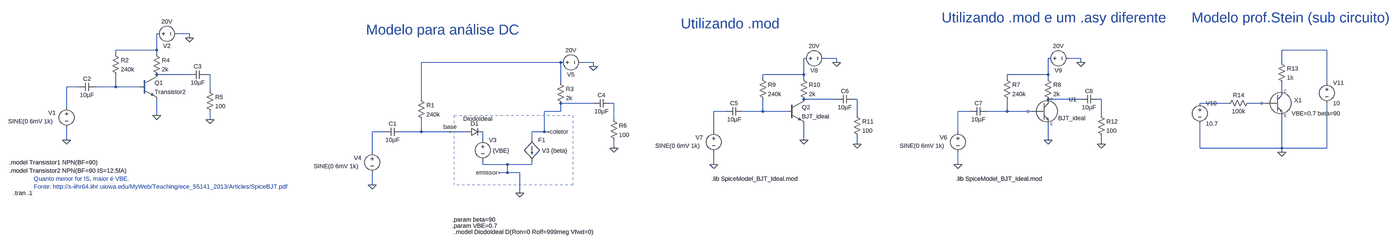
[diagram p0: schematic Tutorial_LTSpice_Ep9-BJT_ideal.asc, whole sheet]
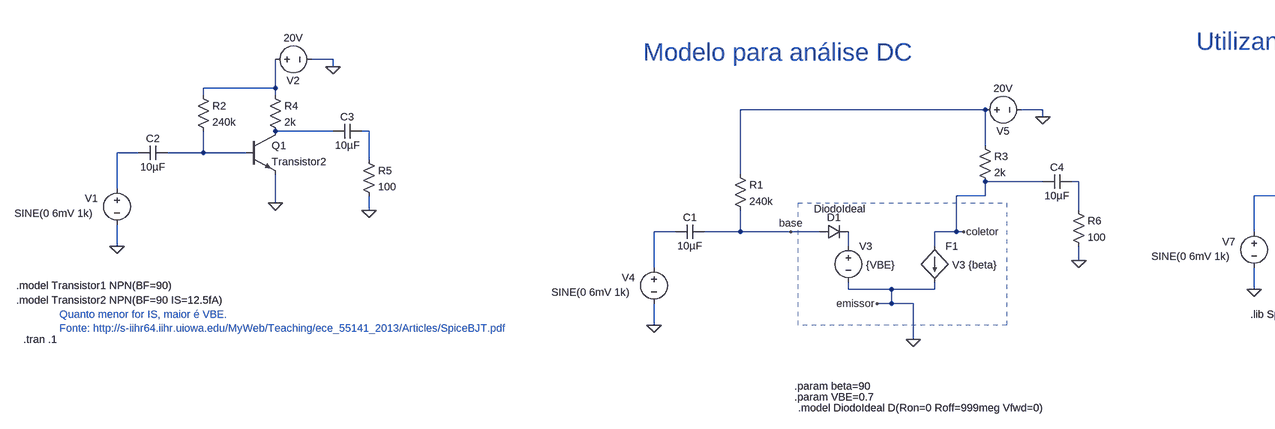
[diagram p1: schematic Tutorial_LTSpice_Ep9-BJT_ideal.asc, part, row 1 of 1, column 1 of 2]
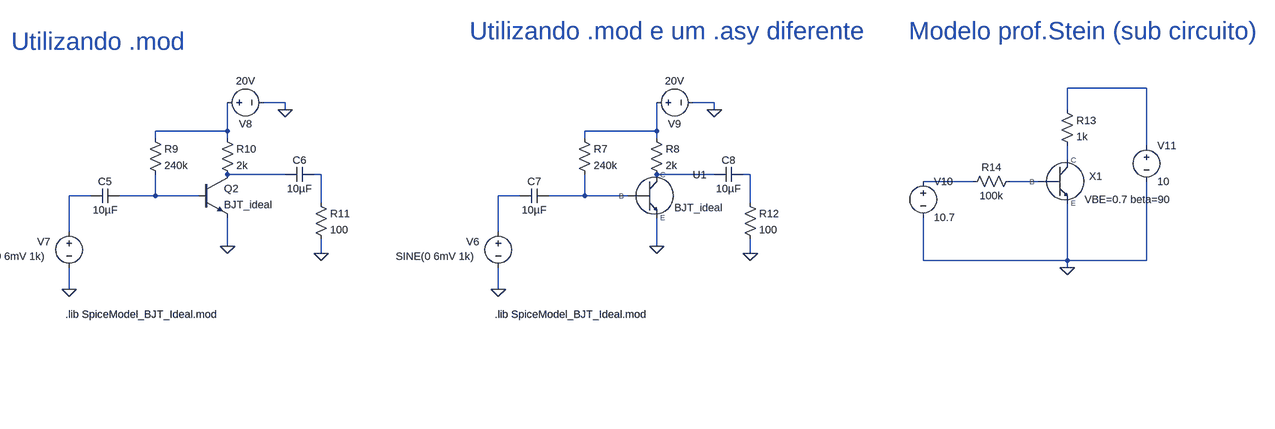
[diagram p2: schematic Tutorial_LTSpice_Ep9-BJT_ideal.asc, part, row 1 of 1, column 2 of 2]
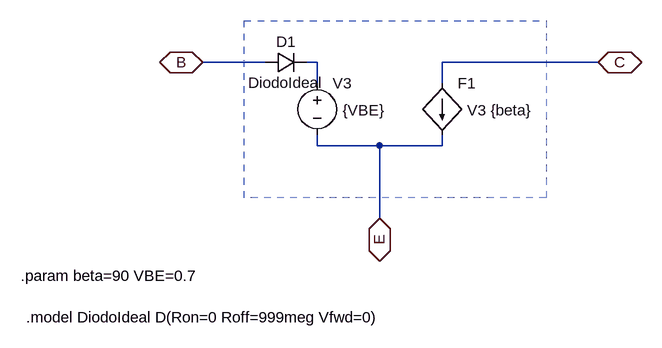
[diagram p3: sub-circuit bjt_ideal.asc]
Tutorial_LTSpice_Ep9-BJT_ideal.asc, the LTspice schematic file:
Version 4
SHEET 1 4108 820
WIRE -880 -608 -928 -608
WIRE -880 -592 -880 -608
WIRE -1008 -544 -1008 -608
WIRE -1008 -544 -1168 -544
WIRE 3776 -544 3600 -544
WIRE -1168 -528 -1168 -544
WIRE -1008 -528 -1008 -544
WIRE 1712 -512 1664 -512
WIRE 2704 -512 2656 -512
WIRE 576 -496 32 -496
WIRE 704 -496 656 -496
WIRE 1712 -496 1712 -512
WIRE 2704 -496 2704 -512
WIRE 3600 -496 3600 -544
WIRE 704 -480 704 -496
WIRE -880 -448 -1008 -448
WIRE -800 -448 -816 -448
WIRE 1584 -448 1584 -512
WIRE 1584 -448 1424 -448
WIRE 2576 -448 2576 -512
WIRE 2576 -448 2416 -448
WIRE 1424 -432 1424 -448
WIRE 1584 -432 1584 -448
WIRE 2416 -432 2416 -448
WIRE 2576 -432 2576 -448
WIRE 576 -416 576 -496
WIRE 3776 -416 3776 -544
WIRE -1312 -400 -1360 -400
WIRE -1168 -400 -1168 -448
WIRE -1168 -400 -1248 -400
WIRE -1072 -400 -1168 -400
WIRE -800 -384 -800 -448
WIRE 3600 -384 3600 -416
WIRE 32 -352 32 -496
WIRE 1712 -352 1584 -352
WIRE 1792 -352 1776 -352
WIRE 2704 -352 2576 -352
WIRE 2784 -352 2768 -352
WIRE 704 -336 576 -336
WIRE 784 -336 768 -336
WIRE 3392 -336 3280 -336
WIRE 3536 -336 3472 -336
WIRE -1360 -320 -1360 -400
WIRE 576 -304 576 -336
WIRE 576 -304 512 -304
WIRE 1280 -304 1232 -304
WIRE 1424 -304 1424 -352
WIRE 1424 -304 1344 -304
WIRE 1520 -304 1424 -304
WIRE 2272 -304 2224 -304
WIRE 2416 -304 2416 -352
WIRE 2416 -304 2336 -304
WIRE 2512 -304 2416 -304
WIRE -1008 -288 -1008 -352
WIRE 1792 -288 1792 -352
WIRE 2784 -288 2784 -352
WIRE -800 -272 -800 -304
WIRE 784 -272 784 -336
WIRE -112 -224 -160 -224
WIRE 32 -224 32 -272
WIRE 32 -224 -48 -224
WIRE 144 -224 32 -224
WIRE 208 -224 144 -224
WIRE 512 -224 512 -304
WIRE 512 -224 464 -224
WIRE 528 -224 512 -224
WIRE 1232 -224 1232 -304
WIRE 2224 -224 2224 -304
WIRE -1360 -192 -1360 -240
WIRE 272 -192 272 -224
WIRE 464 -192 464 -224
WIRE 1584 -192 1584 -256
WIRE 2576 -192 2576 -256
WIRE 1792 -176 1792 -208
WIRE 2784 -176 2784 -208
WIRE 784 -160 784 -192
WIRE 3280 -160 3280 -256
WIRE 3600 -160 3600 -288
WIRE 3600 -160 3280 -160
WIRE 3776 -160 3776 -336
WIRE 3776 -160 3600 -160
WIRE -160 -144 -160 -224
WIRE 3600 -144 3600 -160
WIRE 272 -96 272 -112
WIRE 368 -96 272 -96
WIRE 464 -96 464 -112
WIRE 464 -96 368 -96
WIRE 1232 -96 1232 -144
WIRE 2224 -96 2224 -144
WIRE 368 -64 368 -96
WIRE 368 -64 336 -64
WIRE 416 -64 368 -64
WIRE -160 -16 -160 -64
WIRE 416 16 416 -64
FLAG -800 -272 0
FLAG -1360 -192 0
FLAG -1008 -288 0
FLAG 144 -224 base
FLAG 336 -64 emissor
FLAG 528 -224 coletor
FLAG -880 -592 0
FLAG 784 -160 0
FLAG -160 -16 0
FLAG 416 16 0
FLAG 704 -480 0
FLAG 1792 -176 0
FLAG 1232 -96 0
FLAG 1584 -192 0
FLAG 1712 -496 0
FLAG 2784 -176 0
FLAG 2224 -96 0
FLAG 2576 -192 0
FLAG 2704 -496 0
FLAG 3600 -144 0
SYMBOL npn -1072 -448 R0
SYMATTR InstName Q1
SYMATTR Value Transistor2
SYMBOL res -1184 -544 R0
SYMATTR InstName R2
SYMATTR Value 240k
SYMBOL res -1024 -544 R0
SYMATTR InstName R4
SYMATTR Value 2k
SYMBOL cap -1248 -416 R90
WINDOW 0 0 32 VBottom 2
WINDOW 3 32 32 VTop 2
SYMATTR InstName C2
SYMATTR Value 10µF
SYMBOL cap -816 -464 R90
WINDOW 0 0 32 VBottom 2
WINDOW 3 32 32 VTop 2
SYMATTR InstName C3
SYMATTR Value 10µF
SYMBOL voltage -1360 -336 R0
WINDOW 123 0 0 Left 0
WINDOW 39 0 0 Left 0
WINDOW 0 -71 38 Left 2
WINDOW 3 -228 71 Left 2
SYMATTR InstName V1
SYMATTR Value SINE(0 6mV 1k)
SYMBOL voltage -1024 -608 R270
WINDOW 0 -32 56 VBottom 2
WINDOW 3 32 56 VTop 2
WINDOW 123 0 0 Left 0
WINDOW 39 0 0 Left 0
SYMATTR InstName V2
SYMATTR Value 20V
SYMBOL res -816 -400 R0
SYMATTR InstName R5
SYMATTR Value 100
SYMBOL voltage 272 -208 R0
WINDOW 123 0 0 Left 0
WINDOW 39 0 0 Left 0
WINDOW 3 39 58 Left 2
SYMATTR Value {VBE}
SYMATTR InstName V3
SYMBOL f 464 -192 R0
WINDOW 3 39 42 Left 2
SYMATTR Value V3 {beta}
SYMATTR InstName F1
SYMBOL diode 208 -208 R270
WINDOW 0 32 32 VTop 2
WINDOW 3 83 45 VBottom 2
SYMATTR InstName D1
SYMATTR Value DiodoIdeal
SYMBOL npn 1520 -352 R0
SYMATTR InstName Q2
SYMATTR Value BJT_ideal
SYMATTR Prefix X
SYMBOL res 16 -368 R0
SYMATTR InstName R1
SYMATTR Value 240k
SYMBOL res 560 -432 R0
SYMATTR InstName R3
SYMATTR Value 2k
SYMBOL cap -48 -240 R90
WINDOW 0 0 32 VBottom 2
WINDOW 3 32 32 VTop 2
SYMATTR InstName C1
SYMATTR Value 10µF
SYMBOL cap 768 -352 R90
WINDOW 0 0 32 VBottom 2
WINDOW 3 32 32 VTop 2
SYMATTR InstName C4
SYMATTR Value 10µF
SYMBOL voltage -160 -160 R0
WINDOW 123 0 0 Left 0
WINDOW 39 0 0 Left 0
WINDOW 0 -71 38 Left 2
WINDOW 3 -228 71 Left 2
SYMATTR InstName V4
SYMATTR Value SINE(0 6mV 1k)
SYMBOL voltage 560 -496 R270
WINDOW 0 -32 56 VBottom 2
WINDOW 3 32 56 VTop 2
WINDOW 123 0 0 Left 0
WINDOW 39 0 0 Left 0
SYMATTR InstName V5
SYMATTR Value 20V
SYMBOL res 768 -288 R0
SYMATTR InstName R6
SYMATTR Value 100
SYMBOL res 1408 -448 R0
SYMATTR InstName R9
SYMATTR Value 240k
SYMBOL res 1568 -448 R0
SYMATTR InstName R10
SYMATTR Value 2k
SYMBOL cap 1344 -320 R90
WINDOW 0 0 32 VBottom 2
WINDOW 3 32 32 VTop 2
SYMATTR InstName C5
SYMATTR Value 10µF
SYMBOL cap 1776 -368 R90
WINDOW 0 0 32 VBottom 2
WINDOW 3 32 32 VTop 2
SYMATTR InstName C6
SYMATTR Value 10µF
SYMBOL voltage 1232 -240 R0
WINDOW 123 0 0 Left 0
WINDOW 39 0 0 Left 0
WINDOW 0 -71 38 Left 2
WINDOW 3 -228 71 Left 2
SYMATTR InstName V7
SYMATTR Value SINE(0 6mV 1k)
SYMBOL voltage 1568 -512 R270
WINDOW 0 -32 56 VBottom 2
WINDOW 3 32 56 VTop 2
WINDOW 123 0 0 Left 0
WINDOW 39 0 0 Left 0
SYMATTR InstName V8
SYMATTR Value 20V
SYMBOL res 1776 -304 R0
SYMATTR InstName R11
SYMATTR Value 100
SYMBOL res 2400 -448 R0
SYMATTR InstName R7
SYMATTR Value 240k
SYMBOL res 2560 -448 R0
SYMATTR InstName R8
SYMATTR Value 2k
SYMBOL cap 2336 -320 R90
WINDOW 0 0 32 VBottom 2
WINDOW 3 32 32 VTop 2
SYMATTR InstName C7
SYMATTR Value 10µF
SYMBOL cap 2768 -368 R90
WINDOW 0 0 32 VBottom 2
WINDOW 3 32 32 VTop 2
SYMATTR InstName C8
SYMATTR Value 10µF
SYMBOL voltage 2224 -240 R0
WINDOW 123 0 0 Left 0
WINDOW 39 0 0 Left 0
WINDOW 0 -71 38 Left 2
WINDOW 3 -228 71 Left 2
SYMATTR InstName V6
SYMATTR Value SINE(0 6mV 1k)
SYMBOL voltage 2560 -512 R270
WINDOW 0 -32 56 VBottom 2
WINDOW 3 32 56 VTop 2
WINDOW 123 0 0 Left 0
WINDOW 39 0 0 Left 0
SYMATTR InstName V9
SYMATTR Value 20V
SYMBOL res 2768 -304 R0
SYMATTR InstName R12
SYMATTR Value 100
SYMBOL SpiceModel_BJT_Ideal 2624 -304 R0
WINDOW 40 18 23 Left 0
WINDOW 3 45 42 Bottom 2
SYMATTR InstName U1
SYMBOL res 3584 -512 R0
SYMATTR InstName R13
SYMATTR Value 1k
SYMBOL res 3376 -320 R270
WINDOW 0 32 56 VTop 2
WINDOW 3 0 56 VBottom 2
SYMATTR InstName R14
SYMATTR Value 100k
SYMBOL voltage 3280 -352 R0
WINDOW 123 0 0 Left 0
WINDOW 39 0 0 Left 0
SYMATTR InstName V10
SYMATTR Value 10.7
SYMBOL voltage 3776 -432 R0
WINDOW 123 0 0 Left 0
WINDOW 39 0 0 Left 0
SYMATTR InstName V11
SYMATTR Value 10
SYMBOL BJT_ideal 3648 -336 R0
WINDOW 0 15 4 Bottom 2
WINDOW 39 86 56 Bottom 2
SYMATTR InstName X1
SYMATTR SpiceLine VBE=0.7 beta=90
TEXT -1568 16 Left 2 !.tran .1
TEXT -1584 -72 Left 2 !.model Transistor2 NPN(BF=90 IS=12.5fA)
TEXT -1488 -40 Left 2 ;Quanto menor for IS, maior é VBE.\nFonte: http://s-iihr64.iihr.uiowa.edu/MyWeb/Teaching/ece_55141_2013/Articles/SpiceBJT.pdf
TEXT -1584 -104 Left 2 !.model Transistor1 NPN(BF=90)
TEXT 1224 -40 Left 2 !.lib SpiceModel_BJT_Ideal.mod
TEXT 2216 -40 Left 2 !.lib SpiceModel_BJT_Ideal.mod
TEXT -184 -624 Left 5 ;Modelo para análise DC
TEXT 152 120 Left 2 !.param beta=90
TEXT 152 144 Left 2 !.param VBE=0.7
TEXT 160 168 Left 2 !.model DiodoIdeal D(Ron=0 Roff=999meg Vfwd=0)
TEXT 3248 -672 Left 5 ;Modelo prof.Stein (sub circuito)
TEXT 1104 -648 Left 5 ;Utilizando .mod
TEXT 2160 -672 Left 5 ;Utilizando .mod e um .asy diferente
RECTANGLE Normal 624 -16 160 -288 2

bjt_ideal.asc, the sub-circuit schematic file:
Version 4
SHEET 1 1008 728
WIRE 96 -416 0 -416
WIRE 176 -416 160 -416
WIRE 608 -416 368 -416
WIRE 176 -384 176 -416
WIRE 368 -384 368 -416
WIRE 176 -288 176 -304
WIRE 272 -288 176 -288
WIRE 368 -288 368 -304
WIRE 368 -288 272 -288
WIRE 272 -176 272 -288
FLAG 0 -416 B
IOPIN 0 -416 BiDir
FLAG 272 -176 E
IOPIN 272 -176 BiDir
FLAG 608 -416 C
IOPIN 608 -416 BiDir
SYMBOL voltage 176 -400 R0
WINDOW 123 0 0 Left 0
WINDOW 39 0 0 Left 0
WINDOW 3 39 58 Left 2
SYMATTR Value {VBE}
SYMATTR InstName V3
SYMBOL f 368 -384 R0
WINDOW 3 39 42 Left 2
SYMATTR Value V3 {beta}
SYMATTR InstName F1
SYMBOL diode 96 -400 R270
WINDOW 0 32 32 VTop 2
WINDOW 3 0 32 VBottom 2
SYMATTR InstName D1
SYMATTR Value DiodoIdeal
TEXT -280 -88 Left 2 !.param beta=90 VBE=0.7
TEXT -272 -24 Left 2 !.model DiodoIdeal D(Ron=0 Roff=999meg Vfwd=0)
RECTANGLE Normal 528 -208 64 -480 2

The netlist it stands for:
* Tutorial_LTSpice_Ep9-BJT_ideal.asc
Q1 N004 N009 0 0 Transistor2
R2 N001 N009 240k
R4 N001 N004 2k
C2 N009 N008 10µF
C3 N005 N004 10µF
V1 N008 0 SINE(0 6mV 1k)
V2 N001 0 20V
R5 N005 0 100
V3 N023 0 {VBE}
F1 coletor 0 V3 {beta}
D1 base N023 DiodoIdeal
XQ2 N011 N019 0 BJT_ideal  ; pins C B E
R1 N003 base 240k
R3 N003 coletor 2k
C1 base N022 10µF
C4 N015 coletor 10µF
V4 N022 0 SINE(0 6mV 1k)
V5 N003 0 20V
R6 N015 0 100
R9 N006 N019 240k
R10 N006 N011 2k
C5 N019 N018 10µF
C6 N012 N011 10µF
V7 N018 0 SINE(0 6mV 1k)
V8 N006 0 20V
R11 N012 0 100
R7 N007 N021 240k
R8 N007 N013 2k
C7 N021 N020 10µF
C8 N014 N013 10µF
V6 N020 0 SINE(0 6mV 1k)
V9 N007 0 20V
R12 N014 0 100
XU1 N013 N021 0 BJT_ideal  ; pins C B E
R13 N002 N010 1k
R14 N016 N017 100k
V10 N016 0 10.7
V11 N002 0 10
XX1 N010 N017 0 bjt_ideal params: VBE=0.7 beta=90

* block symbol definitions
.subckt bjt_ideal C B E
V3 N001 E {VBE}
F1 C E V3 {beta}
D1 B N001 DiodoIdeal
.param beta=90 VBE=0.7
.model DiodoIdeal D(Ron=0 Roff=999meg Vfwd=0)
.ends bjt_ideal

.model D D
.lib standard.dio
.model NPN NPN
.model PNP PNP
.lib standard.bjt
.tran .1
.model Transistor2 NPN(BF=90 IS=12.5fA)
* Quanto menor for IS, maior é VBE.
* Fonte: http://s-iihr64.iihr.uiowa.edu/MyWeb/Teaching/ece_55141_2013/Articles/SpiceBJT.pdf
.model Transistor1 NPN(BF=90)
.lib SpiceModel_BJT_Ideal.mod
.lib SpiceModel_BJT_Ideal.mod
* Modelo para análise DC
.param beta=90
.param VBE=0.7
.model DiodoIdeal D(Ron=0 Roff=999meg Vfwd=0)
* Modelo prof.Stein (sub circuito)
* Utilizando .mod
* Utilizando .mod e um .asy diferente
.lib SpiceModel_BJT_Ideal.mod
.backanno
.end